# Altium schematic sheet osc_con.SchDoc
size A4
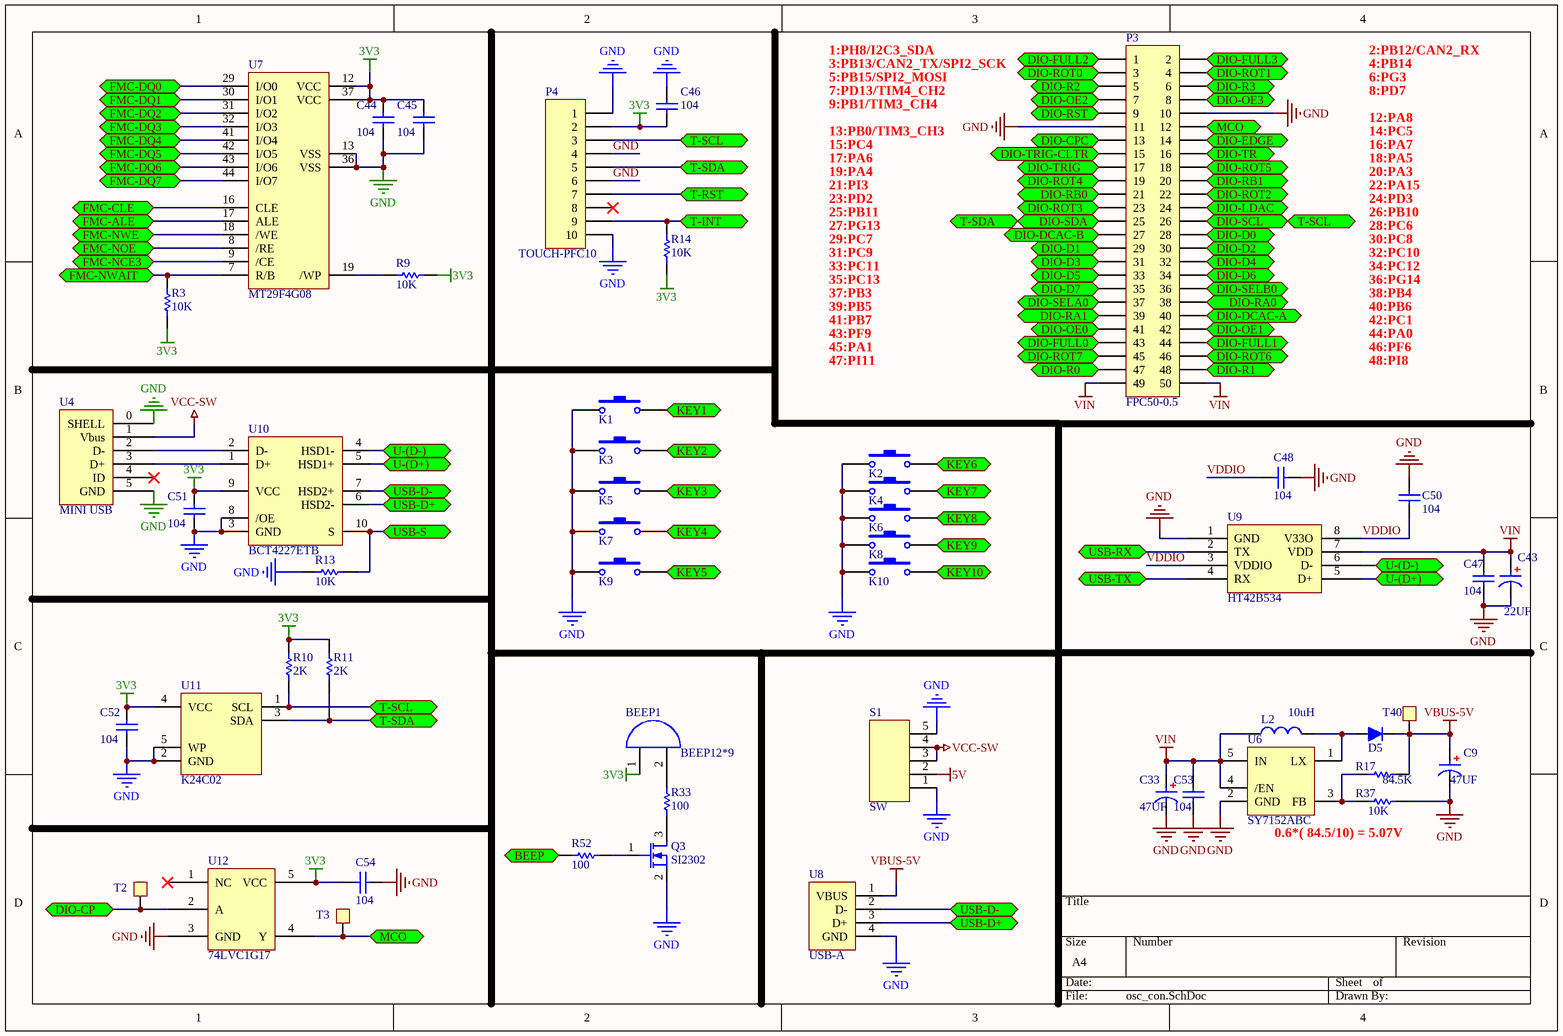
[diagram p0: osc_con.SchDoc]

## Parts
BEEP1  BEEP12*9  [BEEP]
C9  47UF  [CAP-T-3216]
C33  47UF  [CAP-T-3216]
C43  22UF  [0603C]
C44  C0.1uF  [0402]  (value not drawn)
C45  C0.1uF  [0402]  (value not drawn)
C46  C0.1uF  [0402]  (value not drawn)
C47  104  [0402]
C48  104  [0402]
C50  104  [0402]
C51  C0.1uF  [0402]  (value not drawn)
C52  C0.1uF  [0402]  (value not drawn)
C53  104  [0402]
C54  C0.1uF  [0402]  (value not drawn)
D5  1N5918WS  [SOD23-322F]  (value not drawn)
K1  KEY-PB  [KEY_6*6*4.3]  (value not drawn)
K2  KEY-PB  [KEY_6*6*4.3]  (value not drawn)
K3  KEY-PB  [KEY_6*6*4.3]  (value not drawn)
K4  KEY-PB  [KEY_6*6*4.3]  (value not drawn)
K5  KEY-PB  [KEY_6*6*4.3]  (value not drawn)
K6  KEY-PB  [KEY_6*6*4.3]  (value not drawn)
K7  KEY-PB  [KEY_6*6*4.3]  (value not drawn)
K8  KEY-PB  [KEY_6*6*4.3]  (value not drawn)
K9  KEY-PB  [KEY_6*6*4.3]  (value not drawn)
K10  KEY-PB  [KEY_6*6*4.3]  (value not drawn)
L2  10uH  [0805]
P3  FPC50-0.5  [FPC50-0.5]
P4  TOUCH-PFC10  [FPC10-0.5]
Q3  SI2302  [SOT-23-3]
R3  R10K  [0402]  (value not drawn)
R9  R10K  [0402]  (value not drawn)
R10  R2K  [0402]  (value not drawn)
R11  R2K  [0402]  (value not drawn)
R13  R10K  [0402]  (value not drawn)
R14  R10K  [0402]  (value not drawn)
R17  R84.5K  [0402]  (value not drawn)
R33  R100R  [0402]  (value not drawn)
R37  10K  [0402]
R52  R100R  [0402]  (value not drawn)
S1  SW  [SW-3]
T2  TP  [TEST_POINT]  (value not drawn)
T3  TP  [TEST_POINT]  (value not drawn)
T40  TP  [TEST_POINT]  (value not drawn)
U4  MINI USB  [Micro_USB_t]
U6  SY7152ABC  [SOT23-6]
U7  MT29F4G08  [TSOP48]
U8  USB-A  [USB-A-SMA]
U9  HT42B534  [SOP-8]
U10  BCT4227ETB  [WQFN10]
U11  K24C02  [SOT23-5]
U12  74LVC1G17  [SOT23-5]

## Ports
BEEP, DIO-CP, DIO-CPC, DIO-D0, DIO-D1, DIO-D2, DIO-D3, DIO-D4, DIO-D5, DIO-D6, DIO-D7, DIO-DCAC-A, DIO-DCAC-B, DIO-EDGE, DIO-FULL0, DIO-FULL1, DIO-FULL2, DIO-FULL3, DIO-LDAC, DIO-OE0, DIO-OE1, DIO-OE2, DIO-OE3, DIO-R0, DIO-R1, DIO-R2, DIO-R3, DIO-RA0, DIO-RA1, DIO-RB0, DIO-RB1, DIO-ROT0, DIO-ROT1, DIO-ROT2, DIO-ROT3, DIO-ROT4, DIO-ROT5, DIO-ROT6, DIO-ROT7, DIO-RST, DIO-SCL, DIO-SDA, DIO-SELA0, DIO-SELB0, DIO-TR, DIO-TRIG, DIO-TRIG-CLTR, FMC-ALE, FMC-CLE, FMC-DQ0, FMC-DQ1, FMC-DQ2, FMC-DQ3, FMC-DQ4, FMC-DQ5, FMC-DQ6, FMC-DQ7, FMC-NCE3, FMC-NOE, FMC-NWAIT, FMC-NWE, KEY1, KEY2, KEY3, KEY4, KEY5, KEY6, KEY7, KEY8, KEY9, KEY10, MCO, T-INT, T-RST, T-SCL, T-SDA, U-(D+), U-(D-), USB-D+, USB-D-, USB-RX, USB-S, USB-TX

## Nets
3V3: BEEP1.1(A) C44.1 C45.1 C46.2 C51.1 C52.1 C54.1 P4.2 R3.1 R9.2 R10.2 R11.2 R14.1 U7.12(VCC) U7.37(VCC) U10.9(VCC) U11.4(VCC) U12.5(VCC)
5V: S1.2
GND: C9.2 C33.2 C43.2 C44.2 C45.2 C46.1 C47.2 C48.2 C50.2 C51.2 C52.2 C53.2 C54.2 K1.1 K2.1 K3.1 K4.1 K5.1 K6.1 K7.1 K8.1 K9.1 K10.1 P3.10 P3.11 P4.1 P4.4 P4.6 P4.10 Q3.2(S) R13.1 R37.1 S1.1 S1.5 U4.0(SHELL) U4.5(GND) U6.2(GND) U7.13(VSS) U7.36(VSS) U8.4(GND) U9.1(GND) U10.3(GND) U10.8(/OE) U11.2(GND) U11.5(WP) U12.3(GND)
VBUS-5V: C9.1 D5.2(K) R17.2 T40.1(R) U8.1(VBUS)
VCC-SW: S1.3 S1.4 U4.1(Vbus)
VIN: C33.1 C43.1 C47.1 C53.1 L2.1 P3.49 P3.50 U6.4(/EN) U6.5(IN) U9.7(VDD)
BEEP: R52.1 ; port BEEP
DIO-CP: T2.1(R) U12.2(A) ; port DIO-CP
DIO-CPC: P3.13 ; port DIO-CPC
DIO-D0: P3.28 ; port DIO-D0
DIO-D1: P3.29 ; port DIO-D1
DIO-D2: P3.30 ; port DIO-D2
DIO-D3: P3.31 ; port DIO-D3
DIO-D4: P3.32 ; port DIO-D4
DIO-D5: P3.33 ; port DIO-D5
DIO-D6: P3.34 ; port DIO-D6
DIO-D7: P3.35 ; port DIO-D7
DIO-DCAC-A: P3.40 ; port DIO-DCAC-A
DIO-DCAC-B: P3.27 ; port DIO-DCAC-B
DIO-EDGE: P3.14 ; port DIO-EDGE
DIO-FULL0: P3.43 ; port DIO-FULL0
DIO-FULL1: P3.44 ; port DIO-FULL1
DIO-FULL2: P3.1 ; port DIO-FULL2
DIO-FULL3: P3.2 ; port DIO-FULL3
DIO-LDAC: P3.24 ; port DIO-LDAC
DIO-OE0: P3.41 ; port DIO-OE0
DIO-OE1: P3.42 ; port DIO-OE1
DIO-OE2: P3.7 ; port DIO-OE2
DIO-OE3: P3.8 ; port DIO-OE3
DIO-R0: P3.47 ; port DIO-R0
DIO-R1: P3.48 ; port DIO-R1
DIO-R2: P3.5 ; port DIO-R2
DIO-R3: P3.6 ; port DIO-R3
DIO-RA0: P3.38 ; port DIO-RA0
DIO-RA1: P3.39 ; port DIO-RA1
DIO-RB0: P3.21 ; port DIO-RB0
DIO-RB1: P3.20 ; port DIO-RB1
DIO-ROT0: P3.3 ; port DIO-ROT0
DIO-ROT1: P3.4 ; port DIO-ROT1
DIO-ROT2: P3.22 ; port DIO-ROT2
DIO-ROT3: P3.23 ; port DIO-ROT3
DIO-ROT4: P3.19 ; port DIO-ROT4
DIO-ROT5: P3.18 ; port DIO-ROT5
DIO-ROT6: P3.46 ; port DIO-ROT6
DIO-ROT7: P3.45 ; port DIO-ROT7
DIO-RST: P3.9 ; port DIO-RST
DIO-SCL: P3.26 P4.3 R10.1 U11.1(SCL) ; port DIO-SCL, port T-SCL
DIO-SDA: P3.25 P4.5 R11.1 U11.3(SDA) ; port DIO-SDA, port T-SDA
DIO-SELA0: P3.37 ; port DIO-SELA0
DIO-SELB0: P3.36 ; port DIO-SELB0
DIO-TR: P3.16 ; port DIO-TR
DIO-TRIG: P3.17 ; port DIO-TRIG
DIO-TRIG-CLTR: P3.15 ; port DIO-TRIG-CLTR
FMC-ALE: U7.17(ALE) ; port FMC-ALE
FMC-CLE: U7.16(CLE) ; port FMC-CLE
FMC-DQ0: U7.29(I/O0) ; port FMC-DQ0
FMC-DQ1: U7.30(I/O1) ; port FMC-DQ1
FMC-DQ2: U7.31(I/O2) ; port FMC-DQ2
FMC-DQ3: U7.32(I/O3) ; port FMC-DQ3
FMC-DQ4: U7.41(I/O4) ; port FMC-DQ4
FMC-DQ5: U7.42(I/O5) ; port FMC-DQ5
FMC-DQ6: U7.43(I/O6) ; port FMC-DQ6
FMC-DQ7: U7.44(I/O7) ; port FMC-DQ7
FMC-NCE3: U7.9(/CE) ; port FMC-NCE3
FMC-NOE: U7.8(/RE) ; port FMC-NOE
FMC-NWAIT: R3.2 U7.7(R/B) ; port FMC-NWAIT
FMC-NWE: U7.18(/WE) ; port FMC-NWE
KEY1: K1.2 ; port KEY1
KEY2: K3.2 ; port KEY2
KEY3: K5.2 ; port KEY3
KEY4: K7.2 ; port KEY4
KEY5: K9.2 ; port KEY5
KEY6: K2.2 ; port KEY6
KEY7: K4.2 ; port KEY7
KEY8: K6.2 ; port KEY8
KEY9: K8.2 ; port KEY9
KEY10: K10.2 ; port KEY10
MCO: P3.12 T3.1(R) U12.4(Y) ; port MCO
T-INT: P4.9 R14.2 ; port T-INT
T-RST: P4.7 ; port T-RST
U-(D+): U9.5(D+) U10.5(HSD1+) ; port U-(D+)
U-(D-): U9.6(D-) U10.4(HSD1-) ; port U-(D-)
USB-D+: U8.3(D+) U10.6(HSD2-) ; port USB-D+
USB-D-: U8.2(D-) U10.7(HSD2+) ; port USB-D-
USB-RX: U9.2(TX) ; port USB-RX
USB-S: R13.2 U10.10(S) ; port USB-S
USB-TX: U9.4(RX) ; port USB-TX
VDDIO: C48.1 C50.1 U9.3(VDDIO) U9.8(V33O)
NetBEEP1_2: BEEP1.2(B) R33.2
NetD5_1: D5.1(A) L2.2 U6.1(LX)
NetQ3_1: Q3.1(G) R52.2
NetQ3_3: Q3.3(D) R33.1
NetR9_1: R9.1 U7.19(/WP)
NetR17_1: R17.1 R37.2 U6.3(FB)
NetU4_2: U4.2(D-) U10.2(D-)
NetU4_3: U4.3(D+) U10.1(D+)

Not connected (* = marked no-connect by the designer): P4 8*; U4 4(ID)*; U6 6; U12 1(NC)*

## Notes on the sheet
- 1:PH8/I2C3_SDA
- 3:PB13/CAN2_TX/SPI2_SCK
- 5:PB15/SPI2_MOSI
- 7:PD13/TIM4_CH2
- 9:PB1/TIM3_CH4
- 2:PB12/CAN2_RX
- 4:PB14
- 6:PG3
- 8:PD7
- 13:PB0/TIM3_CH3
- 15:PC4
- 17:PA6
- 19:PA4
- 12:PA8
- 14:PC5
- 16:PA7
- 18:PA5
- 20:PA3
- 21:PI3
- 23:PD2
- 25:PB11
- 27:PG13
- 29:PC7
- 22:PA15
- 24:PD3
- 26:PB10
- 28:PC6
- 30:PC8
- 31:PC9
- 33:PC11
- 35:PC13
- 37:PB3
- 39:PB5
- 32:PC10
- 34:PC12
- 36:PG14
- 38:PB4
- 40:PB6
- 41:PB7
- 43:PF9
- 45:PA1
- 47:PI11
- 42:PC1
- 44:PA0
- 46:PF6
- 48:PI8
- 0.6*( 84.5/10) = 5.07V
- (in symbol C0.1uF) 104
- (in symbol R1M) 84.5K
- (in symbol R2K) 10K; 2K
- (in symbol R100R) 100

## Library data of the parts
BEEP1 = Bell: Electrical Bell; Published: 24-Mar-1999; LatestRevisionDate: 17-Jul-2002; LatestRevisionNote: Re-released for DXP Platform.; PackageReference: PIN2; Publisher: Altium Limited
C9 C33 = C10uF: 贴片电容
C43 = C100uF
C47 C48 C50 C53 = C0.1uF
D5 = Diode
L2 = Inductor-100uH
P3 = Header 25X2: Header, 25-Pin, Dual row; LatestRevisionDate: 17-Jul-2002; LatestRevisionNote: Re-released for DXP Platform.; Publisher: Altium Limited
P4 = Header 10: Header, 10-Pin; LatestRevisionDate: 17-Jul-2002; LatestRevisionNote: Re-released for DXP Platform.; Publisher: Altium Limited
Q3 = MOSFET-N
R3 R9 R13 R14 = R2K
R17 R37 = R1M
S1 = HEAD5